# EAGLE design H3_MIDISmallController_Rev_1 (EAGLE 7.6.0)
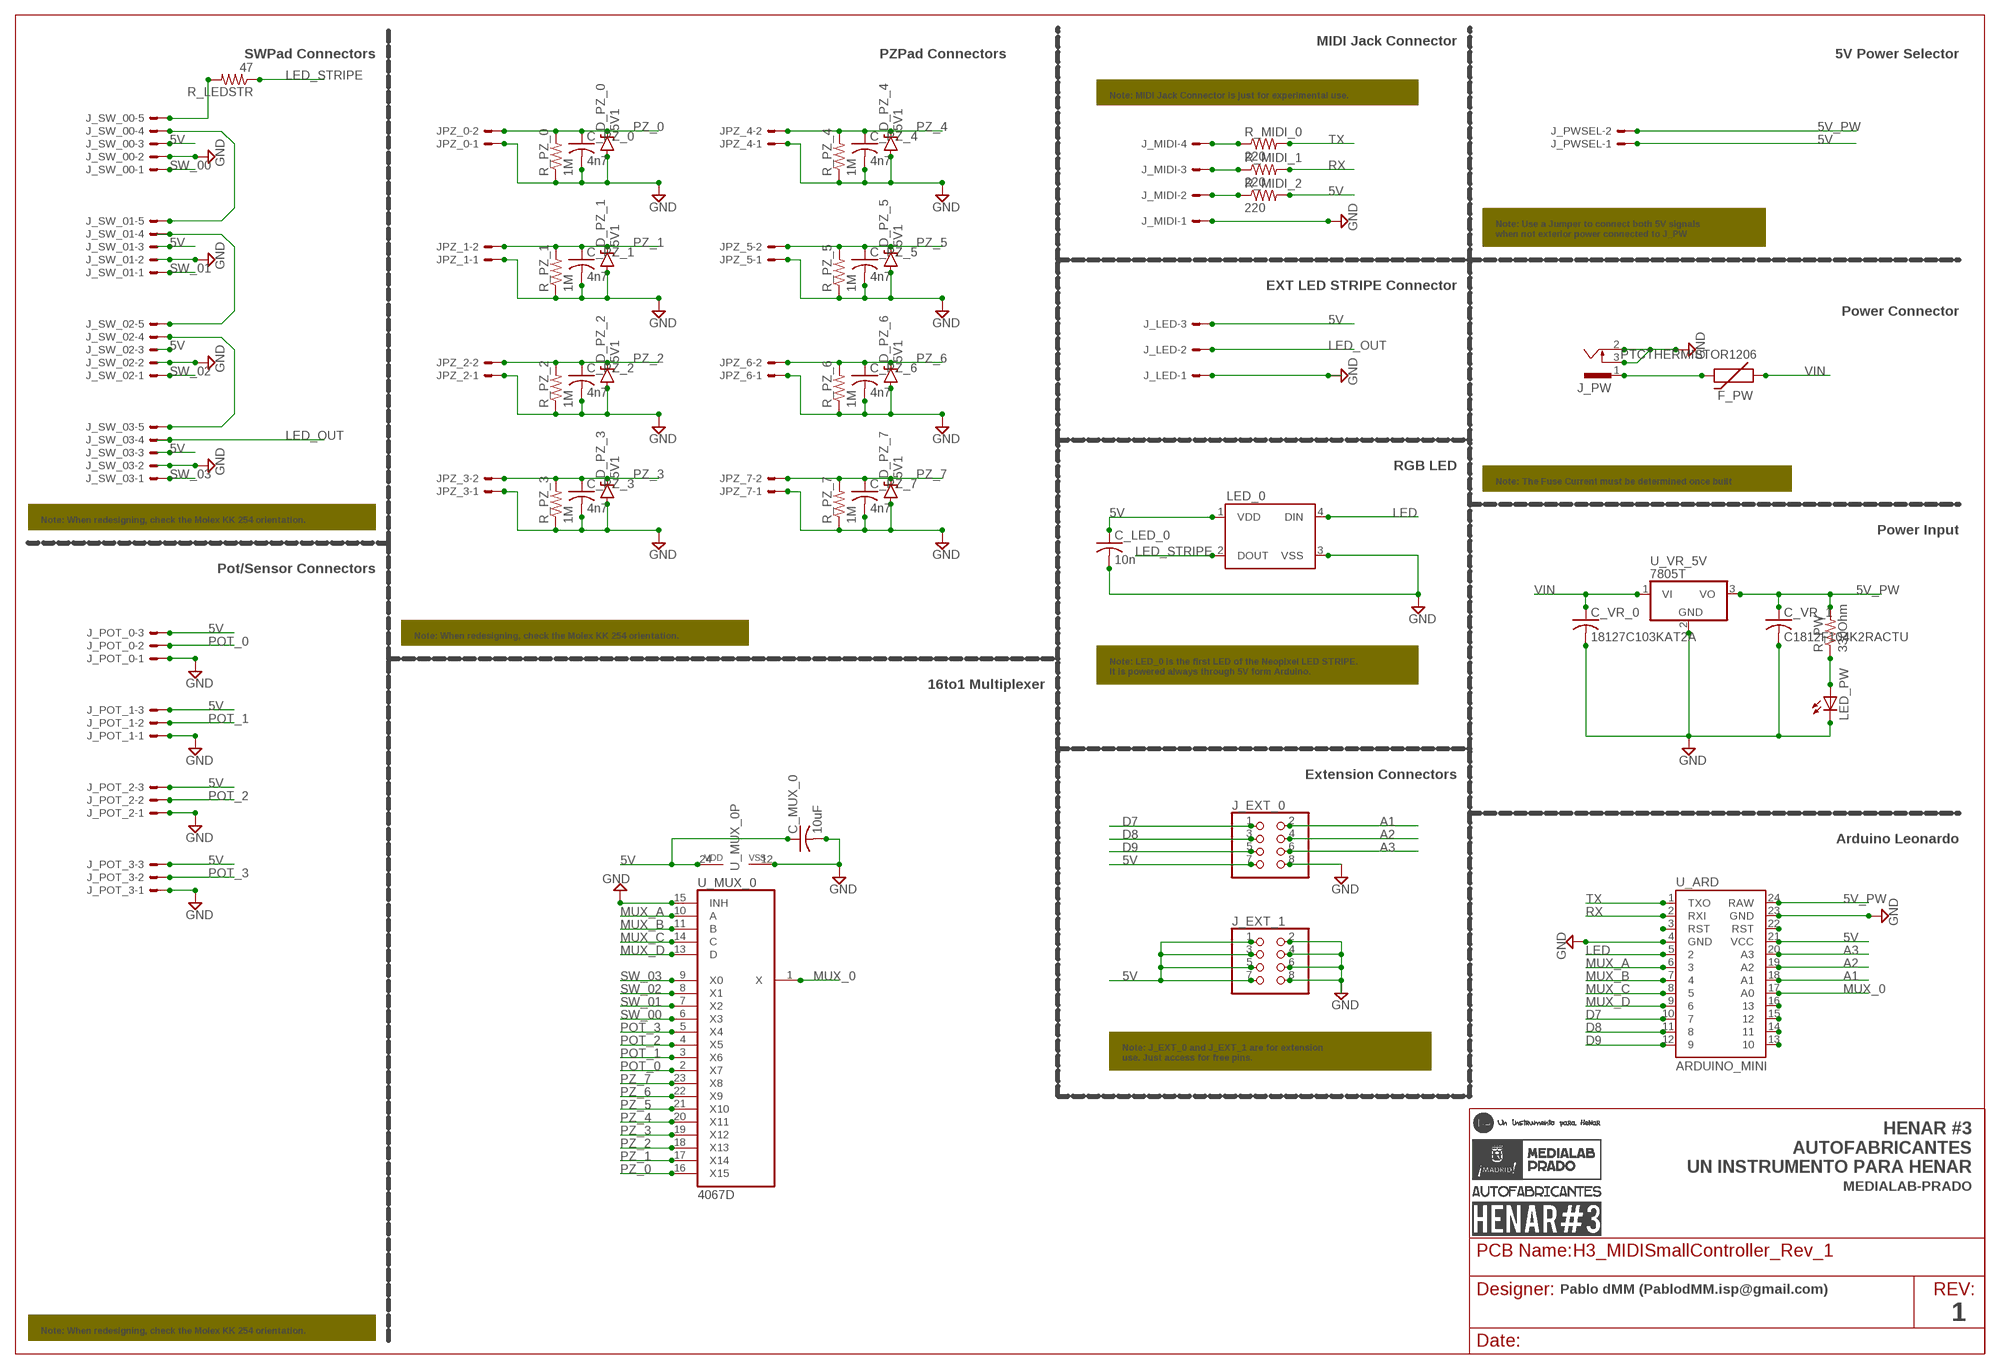
[diagram p0: schematic, sheet 1]

## Parts
C_LED_0  10n  C-USC1206  [C1206]
C_MUX_0  10uF  C-USC1206K  [C1206K]
C_PZ_0  4n7  C-USC1206  [C1206]
C_PZ_1  4n7  C-USC1206  [C1206]
C_PZ_2  4n7  C-USC1206  [C1206]
C_PZ_3  4n7  C-USC1206  [C1206]
C_PZ_4  4n7  C-USC1206  [C1206]
C_PZ_5  4n7  C-USC1206  [C1206]
C_PZ_6  4n7  C-USC1206  [C1206]
C_PZ_7  4n7  C-USC1206  [C1206]
C_VR_0  18127C103KAT2A  C-USC1206  [C1206]
C_VR_1  C1812F104K2RACTU  C-USC1206  [C1206]
D_PZ_0  5V1  DIODE-ZENER  [DIODE-BZT52]
D_PZ_1  5V1  DIODE-ZENER  [DIODE-BZT52]
D_PZ_2  5V1  DIODE-ZENER  [DIODE-BZT52]
D_PZ_3  5V1  DIODE-ZENER  [DIODE-BZT52]
D_PZ_4  5V1  DIODE-ZENER  [DIODE-BZT52]
D_PZ_5  5V1  DIODE-ZENER  [DIODE-BZT52]
D_PZ_6  5V1  DIODE-ZENER  [DIODE-BZT52]
D_PZ_7  5V1  DIODE-ZENER  [DIODE-BZT52]
F_PW  PTCTHERMISTOR1206  [PTC-1206]
J_EXT_0  PINHD-2X4/90  [2X04/90]
J_EXT_1  PINHD-2X4/90  [2X04/90]
J_LED  22-05-7038-03  [7395-03]
J_MIDI  22-05-7048-04  [7395-04]
J_POT_0  22-05-7038-03  [7395-03]
J_POT_1  22-05-7038-03  [7395-03]
J_POT_2  22-05-7038-03  [7395-03]
J_POT_3  22-05-7038-03  [7395-03]
J_PW  SCD-014A  [SCD-014-A]
J_PWSEL  22-05-7028-02  [7395-02]
J_SW_00  22-05-7058-05  [7395-05]
J_SW_01  22-05-7058-05  [7395-05]
J_SW_02  22-05-7058-05  [7395-05]
J_SW_03  22-05-7058-05  [7395-05]
JPZ_0  22-05-7028-02  [7395-02]
JPZ_1  22-05-7028-02  [7395-02]
JPZ_2  22-05-7028-02  [7395-02]
JPZ_3  22-05-7028-02  [7395-02]
JPZ_4  22-05-7028-02  [7395-02]
JPZ_5  22-05-7028-02  [7395-02]
JPZ_6  22-05-7028-02  [7395-02]
JPZ_7  22-05-7028-02  [7395-02]
LED_0  WS2812B  [WS2812B]
LED_PW  LEDSMT1206  [1206]
R_LEDSTR  47  R-US_M1206  [M1206]
R_MIDI_0  220  R-US_M1206  [M1206]
R_MIDI_1  220  R-US_M1206  [M1206]
R_MIDI_2  220  R-US_M1206  [M1206]
R_PW  330Ohm  R-US_M1206  [M1206]
R_PZ_0  1M  R-US_M1206  [M1206]
R_PZ_1  1M  R-US_M1206  [M1206]
R_PZ_2  1M  R-US_M1206  [M1206]
R_PZ_3  1M  R-US_M1206  [M1206]
R_PZ_4  1M  R-US_M1206  [M1206]
R_PZ_5  1M  R-US_M1206  [M1206]
R_PZ_6  1M  R-US_M1206  [M1206]
R_PZ_7  1M  R-US_M1206  [M1206]
U_ARD  ARDUINO_MINI  [ARDUINO_MINI]
U_MUX_0  4067D  [SO24W]
U_VR_5V  7805T  [TO220H]

## Nets
5V: C_LED_0.1 C_MUX_0.1 J_EXT_0.7 J_EXT_1.1 J_EXT_1.3 J_EXT_1.5 J_EXT_1.7 J_LED.3 J_POT_0.3 J_POT_1.3 J_POT_2.3 J_POT_3.3 J_PWSEL.1 J_SW_00.3 J_SW_01.3 J_SW_02.3 J_SW_03.3 LED_0.1(VDD) R_MIDI_2.2 U_ARD.21(VCC) U_MUX_0.24(VDD)
5V_PW [GND]: C_VR_1.1 J_PWSEL.2 R_PW.2 U_ARD.24(RAW) U_VR_5V.3(VO)
A1: J_EXT_0.2 U_ARD.18(A1)
A2: J_EXT_0.4 U_ARD.19(A2)
A3: J_EXT_0.6 U_ARD.20(A3)
D7: J_EXT_0.1 U_ARD.10
D8: J_EXT_0.3 U_ARD.11
D9: J_EXT_0.5 U_ARD.12
GND [GND]: C_LED_0.2 C_MUX_0.2 C_PZ_0.2 C_PZ_1.2 C_PZ_2.2 C_PZ_3.2 C_PZ_4.2 C_PZ_5.2 C_PZ_6.2 C_PZ_7.2 C_VR_0.2 C_VR_1.2 D_PZ_0.A D_PZ_1.A D_PZ_2.A D_PZ_3.A D_PZ_4.A D_PZ_5.A D_PZ_6.A D_PZ_7.A J_EXT_0.8 J_EXT_1.2 J_EXT_1.4 J_EXT_1.6 J_EXT_1.8 J_LED.1 J_MIDI.1 J_POT_0.1 J_POT_1.1 J_POT_2.1 J_POT_3.1 J_PW.2 J_PW.3 J_SW_00.2 J_SW_01.2 J_SW_02.2 J_SW_03.2 JPZ_0.1 JPZ_1.1 JPZ_2.1 JPZ_3.1 JPZ_4.1 JPZ_5.1 JPZ_6.1 JPZ_7.1 LED_0.3(VSS) LED_PW.C R_PZ_0.1 R_PZ_1.1 R_PZ_2.1 R_PZ_3.1 R_PZ_4.1 R_PZ_5.1 R_PZ_6.1 R_PZ_7.1 U_ARD.4(GND) U_ARD.23(GND) U_MUX_0.12(VSS) U_MUX_0.15(INH) U_VR_5V.2(GND)
LED: LED_0.4(DIN) U_ARD.5
LED_IN2: J_SW_01.4 J_SW_02.5
LED_OUT: J_LED.2 J_SW_03.4
LED_STRIPE: LED_0.2(DOUT) R_LEDSTR.1
MUX_0: U_ARD.17(A0) U_MUX_0.1(X)
MUX_A: U_ARD.6 U_MUX_0.10(A)
MUX_B: U_ARD.7 U_MUX_0.11(B)
MUX_C: U_ARD.8 U_MUX_0.14(C)
MUX_D: U_ARD.9 U_MUX_0.13(D)
N$1: LED_PW.A R_PW.1
N$2: J_SW_00.4 J_SW_01.5
N$3: U_ARD.3(RST)
N$4: J_SW_00.5 R_LEDSTR.2
N$5: J_SW_02.4 J_SW_03.5
N$7: U_ARD.22(RST)
N$9: U_ARD.16
N$10: U_ARD.15
N$11: U_ARD.13
N$12: F_PW.2 J_PW.1
N$13: U_ARD.14
N$15: J_MIDI.2 R_MIDI_2.1
N$16: J_MIDI.3 R_MIDI_1.1
N$17: J_MIDI.4 R_MIDI_0.1
POT_0: J_POT_0.2 U_MUX_0.2(X7)
POT_1: J_POT_1.2 U_MUX_0.3(X6)
POT_2: J_POT_2.2 U_MUX_0.4(X5)
POT_3: J_POT_3.2 U_MUX_0.5(X4)
PZ_0: C_PZ_0.1 D_PZ_0.C JPZ_0.2 R_PZ_0.2 U_MUX_0.16(X15)
PZ_1: C_PZ_1.1 D_PZ_1.C JPZ_1.2 R_PZ_1.2 U_MUX_0.17(X14)
PZ_2: C_PZ_2.1 D_PZ_2.C JPZ_2.2 R_PZ_2.2 U_MUX_0.18(X13)
PZ_3: C_PZ_3.1 D_PZ_3.C JPZ_3.2 R_PZ_3.2 U_MUX_0.19(X12)
PZ_4: C_PZ_4.1 D_PZ_4.C JPZ_4.2 R_PZ_4.2 U_MUX_0.20(X11)
PZ_5: C_PZ_5.1 D_PZ_5.C JPZ_5.2 R_PZ_5.2 U_MUX_0.21(X10)
PZ_6: C_PZ_6.1 D_PZ_6.C JPZ_6.2 R_PZ_6.2 U_MUX_0.22(X9)
PZ_7: C_PZ_7.1 D_PZ_7.C JPZ_7.2 R_PZ_7.2 U_MUX_0.23(X8)
RX: R_MIDI_1.2 U_ARD.2(RXI)
SW_00: J_SW_00.1 U_MUX_0.6(X3)
SW_01: J_SW_01.1 U_MUX_0.7(X2)
SW_02: J_SW_02.1 U_MUX_0.8(X1)
SW_03: J_SW_03.1 U_MUX_0.9(X0)
TX: R_MIDI_0.2 U_ARD.1(TXO)
VIN: C_VR_0.1 F_PW.1 U_VR_5V.1(VI)

## Notes on the sheet
- MIDI Jack Connector
- SWPad Connectors | PZPad Connectors | 5V Power Selector
- Note: MIDI Jack Connector is just for experimental use.
- Note: Use a Jumper to connect both 5V signals
  when not exterior power connected to J_PW
- EXT LED STRIPE Connector
- Power Connector
- RGB LED
- Note: The Fuse Current must be determined once built
- Note: When redesigning, check the Molex KK 254 orientation.
- Power Input
- Pot/Sensor Connectors
- Note: When redesigning, check the Molex KK 254 orientation.
- Note: LED_0 is the first LED of the Neopixel LED STRIPE.
  It is powered always through 5V form Arduino.
- 16to1 Multiplexer
- Extension Connectors
- Arduino Leonardo
- Note: J_EXT_0 and J_EXT_1 are for extension
  use. Just access for free pins.
- HENAR #3
  AUTOFABRICANTES
  UN INSTRUMENTO PARA HENAR
- MEDIALAB-PRADO
- Pablo dMM (PablodMM.isp@gmail.com)
- 1
- Note: When redesigning, check the Molex KK 254 orientation.

## Library data of the parts
C_LED_0 C_MUX_0 C_PZ_0 C_PZ_1-C_PZ_7 C_VR_0 C_VR_1 = adafruit:C-US: CAPACITOR, American symbol
D_PZ_0 D_PZ_1-D_PZ_7 = SparkFun-DiscreteSemi:DIODE-ZENER: Zener Diode Production Part - 8199 3.4V Zener Voltage; PROD-ID: DIO-08199; VALUE: BZT52
F_PW = SparkFun-PowerIC:PTC: Resettable Fuse PTC Resettable Fuse. Spark Fun Electronics SKU : COM-08357; PROD_ID: RES-08585
J_EXT_0 J_EXT_1 = adafruit:PINHD-2X4: PIN HEADER
J_LED J_POT_0 J_POT_1-J_POT_3 = con-molex:22-?-03: CONNECTOR wire to board 2.54 mm (.1 inch) pitch header; OC_FARNELL: unknown; OC_NEWARK: unknown
J_MIDI = con-molex:22-?-04: CONNECTOR wire to board 2.54 mm (.1 inch) pitch header; OC_FARNELL: unknown; OC_NEWARK: unknown
J_PW = con-shiua-chyuan:SCD-014A: Power Jack 2.5mm; OC_FARNELL: unknown; OC_NEWARK: unknown
J_PWSEL JPZ_0 JPZ_1-JPZ_7 = con-molex:22-?-02: CONNECTOR wire to board 2.54 mm (.1 inch) pitch header; OC_FARNELL: 9731601; OC_NEWARK: unknown
J_SW_00 J_SW_01-J_SW_03 = con-molex:22-?-05: CONNECTOR wire to board 2.54 mm (.1 inch) pitch header; OC_FARNELL: unknown; OC_NEWARK: unknown
LED_0 = SparkFun-LED:WS2812B: WS2812B - Intelligent control LED integrated light source Technical Specifications: Power Supply Voltage (VDD): 3.5 to 5.3 V Input Voltage (VI): -0.5 to VDD+0.5 V Operating Junction Temperature (Topt): -25°C to +80°C Storage Temperature Range (Tstg): -55°C to +150°C; PROD_ID: DIO-12503
LED_PW = adafruit:LED: LED OSRAM: - CHIPLED LG R971, LG N971, LY N971, LG Q971, LY Q971, LO R971, LY R971 LH N974, LH R974 LS Q976, LO Q976, LY Q976 LO Q996 - Hyper CHIPLED LW Q18S LB Q993, LB Q99A, LB R99A - SideLED LS A670, LO A670, LY A670, LG A670, LP A670 LB A673, LV A673, LT A673, LW A673 LH A674 LY A675 LS A676, LA A676, LO A676, LY A676, LW A676 LS A679, LY A679, LG A679 - Hyper Micro SIDELED® LS Y876, LA Y876, LO Y876, LY Y876 LT Y87S - SmartLED LW L88C, LW L88S LB L89C, LB L89S, LG L890 LS L89K, LO L89K, LY L89K LS L896, LA L896, LO L896, LY L896 - TOPLED LS T670, LO T670, LY T670, LG T670, LP T670 LSG T670, LSP T670, LSY T670, LOP T670, LYG T670 LG T671, LOG T671, LSG T671 LB T673, LV T673, LT T673, LW T673 LH T674 LS T676, LA T676, LO T676, LY T676, LB T676, LH T676, LSB T676, LW T676 LB T67C, LV T67C, LT T67C, LS T67K, LO T67K, LY T67K, LW E67C LS E67B, LA E67B, LO E67B, LY E67B, LB E67C, LV E67C, LT E67C LW T67C LS T679, LY T679, LG T679 LS T770, LO T770, LY T770, LG T770, LP T770 LB T773, LV T773, LT T773, LW T773 LH T774 LS E675, LA E675, LY E675, LS T675 LS T776, LA T776, LO T776, LY T776, LB T776 LHGB T686 LT T68C, LB T68C - Hyper Mini TOPLED® LB M676 - Mini TOPLED Santana® LG M470 LS M47K, LO M47K, LY M47K Source: http://www.osram.convergy.de/
R_LEDSTR R_MIDI_0 R_MIDI_1 R_MIDI_2 R_PW R_PZ_0 R_PZ_1-R_PZ_7 = adafruit:R-US_: RESISTOR, American symbol
U_ARD = SparkFun-Boards:ARDUINO_MINI: Arduino Pro Mini footprint
U_MUX_0 = 40xx:4067: 16-channel ANALOG MULTIPLEXER
U_VR_5V = adafruit:78*: Positive VOLTAGE REGULATOR Added bigger pads to the TO-92 package

## Net classes
1 GND: width 0.635 mm

## Board
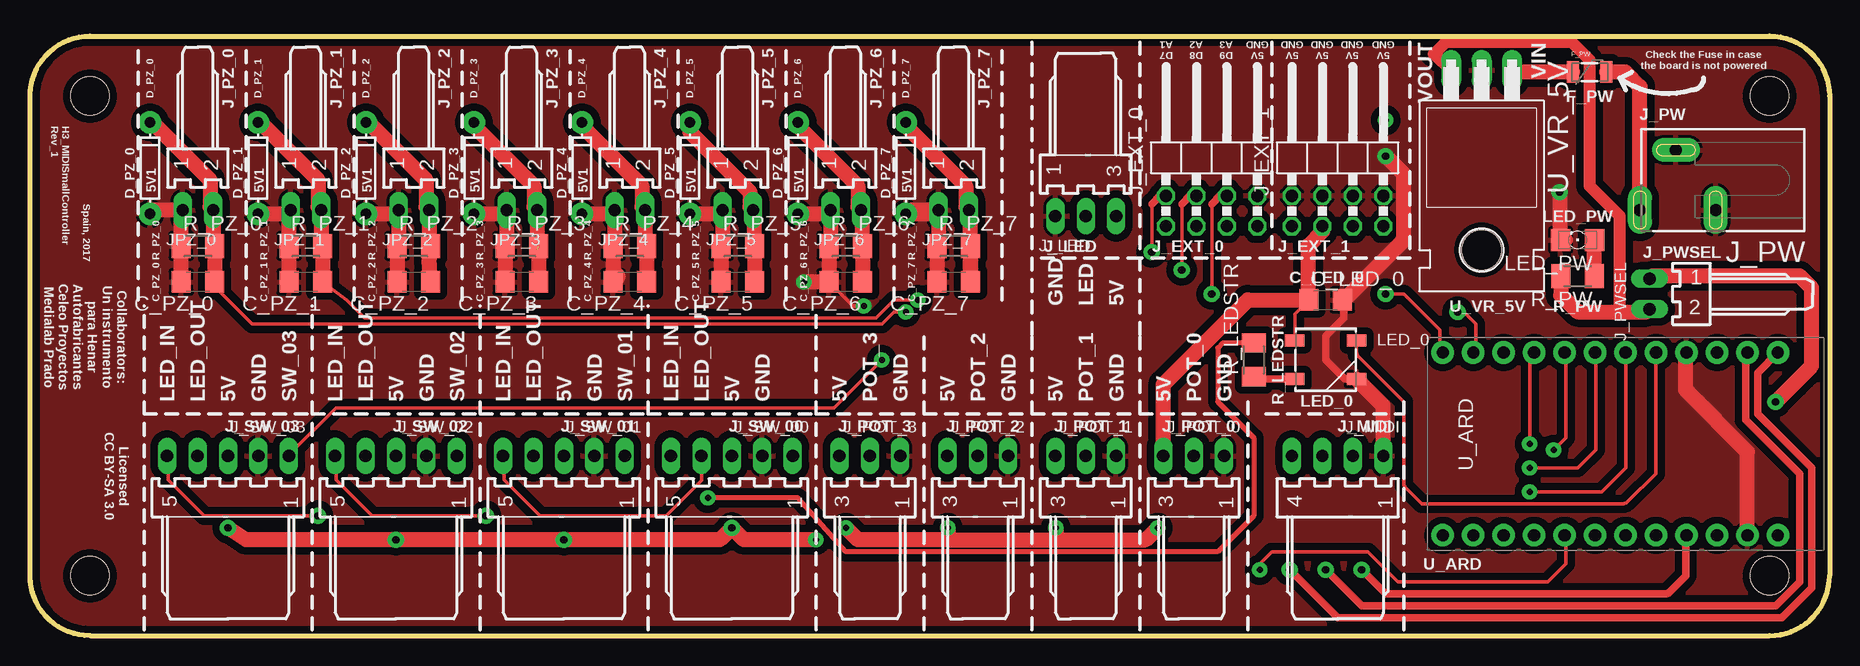
[diagram p1: board, top side]
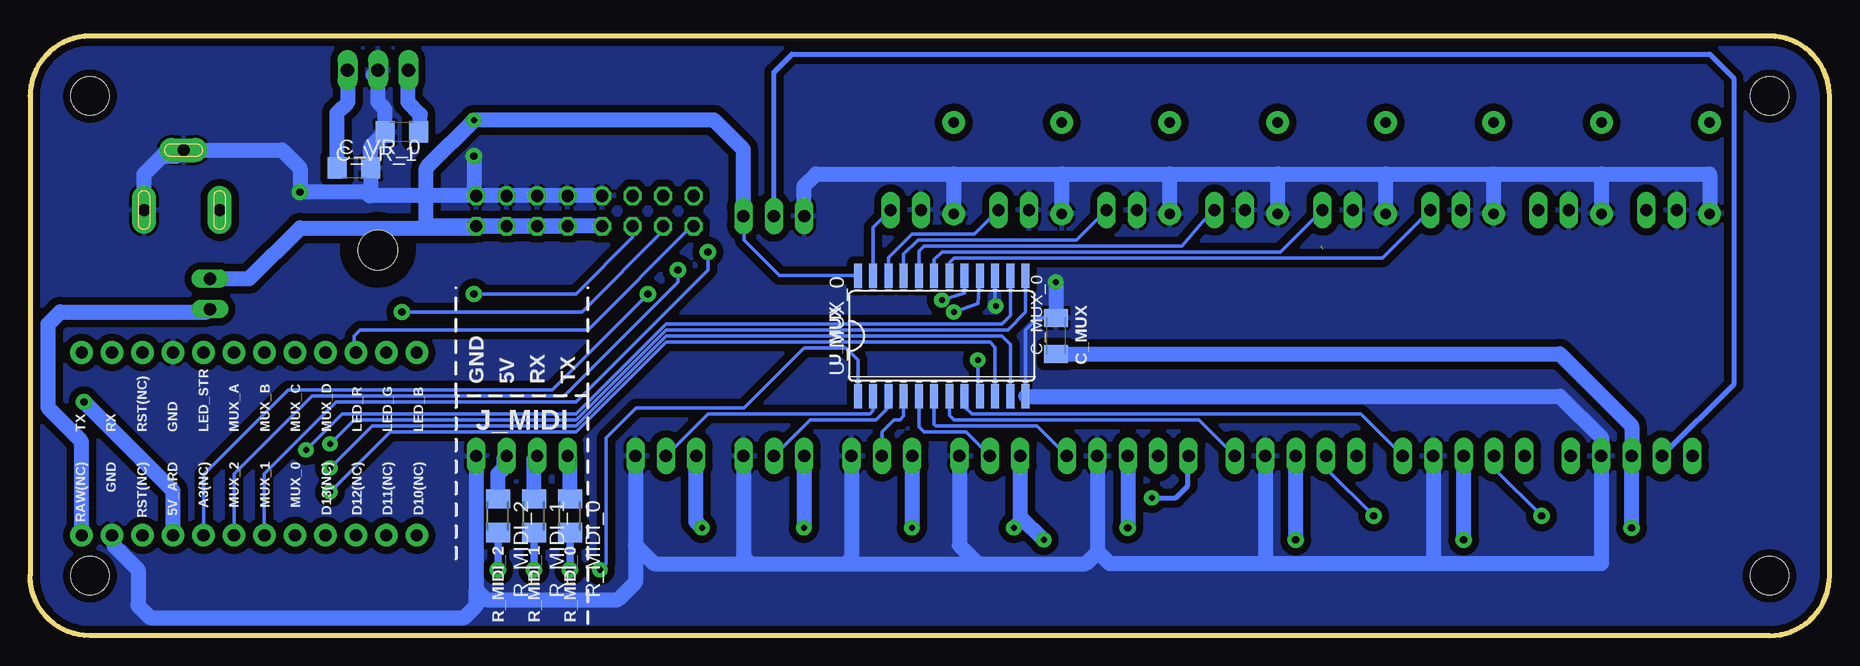
[diagram p2: board, bottom side, seen from below]

Size 150 x 50 mm. Coordinates in mm from the lower left corner, seen from the top.
Outline: 5,0 145,0 arc90 150,5 150,45 arc90 145,50 5,50 arc90 0,45 0,5 arc90 5,0
Copper layers (1*16): Top 0.035mm / dielectric 1.5mm / Bottom 0.035mm
Design rules "default *": minimum track width 10mil, minimum drill 25mil, track to track 10mil, track to pad 10mil, pad to pad 10mil, via to via 10mil, smd to smd 8mil, copper to edge 20mil, drill to drill 8mil, minimum pad ring 10mil, minimum via ring 15mil, stop-mask expansion 4mil, vias tented up to drill 0mil, thermal gap 10mil
Holes 3.2 mm at 5,5 5,45 145,45 145,5

### Footprints (pad centres in the part's own frame; a part is rotated, then mirrored left to right if it is on the bottom)
C1206 = smd 1.6 x 1.8: 1 -1.4,0; 2 1.4,0
C1206K = smd 1.5 x 2: 1 -1.5,0; 2 1.5,0
DIODE-BZT52 = drill 0.9 pad 1.88: A -3.81,0; C 3.81,0
PTC-1206 = smd 1 x 1.8: 1 -1.4,0; 2 1.4,0
2X04/90 = drill 1.016 octagon: 1 -3.81,-6.35; 2 -3.81,-3.81; 3 -1.27,-6.35; 4 -1.27,-3.81; 5 1.27,-6.35; 6 1.27,-3.81; 7 3.81,-6.35; 8 3.81,-3.81
7395-03 = drill 1.016 long: 1 2.54,0; 2 0,0; 3 -2.54,0
7395-04 = drill 1.016 long: 1 3.81,0; 2 1.27,0; 3 -1.27,0; 4 -3.81,0
SCD-014-A = drill 1 pad 2 long: 1 -2.5,13.8; 2 -2.5,7.5; 3 2.5,10.8
7395-02 = drill 1.016 long: 1 1.27,0; 2 -1.27,0
7395-05 = drill 1.016 long: 1 5.08,0; 2 2.54,0; 3 0,0; 4 -2.54,0; 5 -5.08,0
WS2812B = smd 1.651 x 1: 1 -2.577,1.6; 2 -2.577,-1.6; 3 2.577,-1.6; 4 2.577,1.6
1206 = smd 1.6 x 1.803: A -1.422,0; C 1.422,0
M1206 = smd 1.6 x 2: 1 -1.4,0; 2 1.4,0
ARDUINO_MINI = drill 1.016 pad 1.88: 1 -7.62,12.7; 2 -7.62,10.16; 3 -7.62,7.62; 4 -7.62,5.08; 5 -7.62,2.54; 6 -7.62,0; 7 -7.62,-2.54; 8 -7.62,-5.08; 9 -7.62,-7.62; 10 -7.62,-10.16; 11 -7.62,-12.7; 12 -7.62,-15.24; 13 7.62,-15.24; 14 7.62,-12.7; 15 7.62,-10.16; 16 7.62,-7.62; 17 7.62,-5.08; 18 7.62,-2.54; 19 7.62,0; 20 7.62,2.54; 21 7.62,5.08; 22 7.62,7.62; 23 7.62,10.16; 24 7.62,12.7
SO24W = smd 0.66 x 2.032: 1 -6.985,-5.029; 2 -5.715,-5.029; 3 -4.445,-5.029; 4 -3.175,-5.029; 5 -1.905,-5.029; 6 -0.635,-5.029; 7 0.635,-5.029; 8 1.905,-5.029; 9 3.175,-5.029; 10 4.445,-5.029; 11 5.715,-5.029; 12 6.985,-5.029; 13 6.985,5.029; 14 5.715,5.029; 15 4.445,5.029; 16 3.175,5.029; 17 1.905,5.029; 18 0.635,5.029; 19 -0.635,5.029; 20 -1.905,5.029; 21 -3.175,5.029; 22 -4.445,5.029; 23 -5.715,5.029; 24 -6.985,5.029
TO220H = drill 1.118 long: 1 -2.54,-10.16; 2 0,-10.16; 3 2.54,-10.16 | hole 3.302: 0,4.826

### Placement (x,y rotation side)
C_LED_0  108,28 0 top
C_MUX_0  64.5,25 90 bottom
C_PZ_0  14,29.5 180 top
C_PZ_1  23,29.5 180 top
C_PZ_2  32,29.5 180 top
C_PZ_3  41,29.5 180 top
C_PZ_4  50,29.5 180 top
C_PZ_5  59,29.5 180 top
C_PZ_6  68,29.5 180 top
C_PZ_7  77,29.5 180 top
C_VR_0  123,39 0 bottom
C_VR_1  119,42 180 bottom
D_PZ_0  10,39 90 top
D_PZ_1  19,39 90 top
D_PZ_2  28,39 90 top
D_PZ_3  37,39 90 top
D_PZ_4  46,39 90 top
D_PZ_5  55,39 90 top
D_PZ_6  64,39 90 top
D_PZ_7  73,39 90 top
F_PW  130,47 0 top
J_EXT_0  98.5,40.5 0 top
J_EXT_1  109,40.5 0 top
J_LED  88,35 180 top
J_MIDI  109,15 0 top
J_POT_0  97,15 0 top
J_POT_1  88,15 0 top
J_POT_2  79,15 0 top
J_POT_3  70,15 0 top
J_PW  148,38 90 top
J_PWSEL  135,28.5 90 top
J_SW_00  58.5,15 0 top
J_SW_01  44.5,15 0 top
J_SW_02  30.5,15 0 top
J_SW_03  16.5,15 0 top
JPZ_0  14,35.5 180 top
JPZ_1  23,35.5 180 top
JPZ_2  32,35.5 180 top
JPZ_3  41,35.5 180 top
JPZ_4  50,35.5 180 top
JPZ_5  59,35.5 180 top
JPZ_6  68,35.5 180 top
JPZ_7  77,35.5 180 top
LED_0  108,23 0 top
LED_PW  129,33 180 top
R_LEDSTR  102,23 90 top
R_MIDI_0  105,10 270 bottom
R_MIDI_1  108,10 270 bottom
R_MIDI_2  111,10 270 bottom
R_PW  129,30 180 top
R_PZ_0  14,32.5 0 top
R_PZ_1  23,32.5 0 top
R_PZ_2  32,32.5 0 top
R_PZ_3  41,32.5 0 top
R_PZ_4  50,32.5 0 top
R_PZ_5  59,32.5 0 top
R_PZ_6  68,32.5 0 top
R_PZ_7  77,32.5 0 top
U_ARD  133,16 270 top
U_MUX_0  74,25 0 bottom
U_VR_5V  121,37 180 top

### Tracks (layer width: path | path; a pad name or v marks a point on that pad's centre or on a via)
5V  (via drill 0.5, 0.6)
  Top 0.305: LED_0.1 105.42,26.82 C_LED_0.1
  Top 0.61: v111,5.5 113,3.5 136.37,3.5 arc45 136.59,3.59 138,5 138,8.19 arc-45 U_ARD.21
  Top 1.27: v145.5,19.5 148.5,22.5 148.5,29 147.5,30 135.23,30 J_PWSEL.1 | J_EXT_1.3 107.73,33.73 106.5,32.5 106.5,28.1 C_LED_0.1 101.5,28 94.46,20.96 J_POT_0.3 | v68,9 69,8 76.5,8 | v94,9 93,8 85.5,8 | v85.5,9 85.5,8 | v76.5,9 76.5,8 | 76.5,8 85.5,8 | v16.5,9 18,8 v30.5,8 v44.5,8 57.5,8 v58.5,9 59.5,8 v65.5,8
  Bottom 0.305: U_MUX_0.24 87.53,30.03 90.5,33 90.5,34.96 J_LED.3
  Bottom 0.61: R_MIDI_2.2 v111,5.5
  Bottom 1.27: U_ARD.21 138.08,12.08 v145.5,19.5 | J_PWSEL.1 131.73,29.77 127.5,34 117,34 | 117,34 112.96,34 J_EXT_1.7 J_EXT_1.5 J_EXT_1.3 J_EXT_1.1 J_EXT_0.7 116.64,34.15 arc-45 117,34 | 117,34 117,38.74 arc45 116.81,39.19 v113,43 93,43 90.54,40.54 J_LED.3 | v68,9 67.46,9.54 J_POT_3.3 67.46,9.96 v65.5,8 | v94,9 94.5,9.5 94.5,14.96 J_POT_0.3 | J_POT_2.3 76.46,9.04 v76.5,9 | J_POT_1.3 85.46,9.04 v85.5,9 | J_SW_00.3 v58.5,9 | C_MUX_0.1 22.5,23.5 16.5,17.5 J_SW_03.3 v16.5,9 | v44.5,8 J_SW_01.3 | v30.5,8 J_SW_02.3
5V_PW
  Top 1.016: 132.5,27 132.5,35 130,37.5 130,48 128.5,49.5 118,49.5 117,48.5 117.12,48.5 U_VR_5V.3
  Top 1.27: J_PWSEL.2 134.77,27 132.5,27 129,27 127.6,28.4 R_PW.2
  Bottom 1.27: C_VR_1.1 117.46,42.14 117.46,43.46 118.5,44.5 118.5,47.12 U_VR_5V.3 | U_ARD.24 145.7,16.2 148.5,19 148.5,26 147.5,27 135.23,27 J_PWSEL.2
A1  (via drill 0.6)
  Top 0.305: 93.5,36 v93.5,32
  Top 0.61: J_EXT_0.2 94.19,36.69 93.5,36
  Bottom 0.305: v93.5,32 93.5,30.5 104.5,19.5 124.5,19.5 130.5,13.5 130.5,8.42 U_ARD.18
A2  (via drill 0.6)
  Top 0.305: 96,36 v96,30.5
  Top 0.61: J_EXT_0.4 96.69,36.69 96,36
  Bottom 0.305: v96,30.5 96,29.5 105.5,20 126.5,20 133,13.5 U_ARD.19
A3  (via drill 0.6)
  Top 0.305: 98.5,36 v98.5,28.5
  Top 0.61: J_EXT_0.6 99.19,36.69 98.5,36
  Bottom 0.305: U_ARD.20 135.54,13.46 128.5,20.5 106.5,20.5 v98.5,28.5
D7
  Bottom 0.305: J_EXT_0.1 94.85,34.15 103.5,25.5 122.5,25.5 123,25 123,23.78 U_ARD.10
D8  (via drill 0.6)
  Top 0.305: v119,27 119.5,27 120.5,26 120.5,23.82 U_ARD.11
  Bottom 0.305: J_EXT_0.3 97.23,33.77 104,27 v119,27
D9  (via drill 0.6)
  Top 0.305: v113,28.5 114.5,28.5 117.5,25.5 117.5,23.88 U_ARD.12
  Bottom 0.305: J_EXT_0.5 99.77,33.23 104.5,28.5 v113,28.5
GND  (via drill 0.5, 0.6)
  Top 0.305: v69.5,27.5 68.6,27.5 C_PZ_6.2
  Top 0.61: LED_0.3 109.6,21.4 108,23 108,25 109.5,26.5 109.5,27.9 C_LED_0.2
  Top 1.27: 128,33 LED_PW.C 127.5,33.08 v127.5,37 | C_LED_0.2 109.5,28 114.5,33 114.5,38.5 v113,40 | J_MIDI.1 112.81,19.17 LED_0.3 | C_PZ_0.2 R_PZ_0.1 12.6,35.37 JPZ_0.1 10.31,35.5 D_PZ_0.A | C_PZ_1.2 R_PZ_1.1 21.6,35 | 21.6,35 21.6,35.37 JPZ_1.1 | D_PZ_1.A 21.41,35.19 21.6,35 | D_PZ_2.A 30.42,35.19 JPZ_2.1 30.73,32.63 R_PZ_2.1 C_PZ_2.2 | D_PZ_3.A 39.42,35.19 JPZ_3.1 39.73,32.63 R_PZ_3.1 C_PZ_3.2 | D_PZ_4.A 48.42,35.19 JPZ_4.1 48.73,32.63 R_PZ_4.1 48.6,30.4 49,30 49,29.9 C_PZ_4.2 | D_PZ_5.A 57.42,35.19 JPZ_5.1 57.73,32.63 R_PZ_5.1 C_PZ_5.2 | D_PZ_6.A 66.42,35.19 JPZ_6.1 66.73,32.63 R_PZ_6.1 C_PZ_6.2 v64.5,29.5 | D_PZ_7.A 75.42,35.19 JPZ_7.1 | JPZ_7.1 75.73,32.63 R_PZ_7.1 C_PZ_7.2 | JPZ_7.1 73.5,35.5 v73,35 | U_ARD.23 143.16,15.34 138,20.5 138,23.54 U_ARD.4
  Bottom 0.305: U_MUX_0.12 67.02,25.48 66,26.5 C_MUX_0.2 | U_MUX_0.15 69.56,27.55 v69.5,27.5
  Bottom 1.27: J_PW.2 140.5,38.5 139,40 137.7,40 J_PW.3 129,40.5 127.5,39 v127.5,37 122,37 | 121.4,46.76 U_VR_5V.2 121,44.5 120.4,43.9 C_VR_1.2 121.6,40.8 C_VR_0.2 121.6,37.4 122,37 | J_EXT_0.8 J_EXT_1.2 J_EXT_1.4 J_EXT_1.6 J_EXT_1.8 | J_EXT_1.8 121.69,36.69 122,37 | 33,6 19,6 19.04,6.04 J_SW_03.2 19,15.04 19,16.5 22.47,19.97 U_MUX_0.12 | 33,6 47,6 | 47,6 60,6 61,7 | 61,7 61,14.96 J_SW_00.2 | J_SW_01.2 47.04,6.04 47,6 | J_SW_02.2 33.04,6.04 33,6 | J_MIDI.1 112.81,3.81 | 112.81,3.81 112.81,2.5 113.72,1.59 arc45 113.94,1.5 140,1.5 140.91,2.41 arc45 141,2.63 141,5.5 142.91,7.41 arc45 143,7.63 | 112.81,3.81 112,3 101,3 99.54,4.46 99.54,7.54 | v113,40 113,36.88 J_EXT_1.8 | J_POT_3.1 72.54,7.54 71,6 | 71,6 62,6 61,7 | J_POT_0.1 99.54,7.54 | 99.54,7.54 98,6 90,6 | 90,6 82,6 | 82,6 71,6 | J_POT_2.1 81.54,6.46 82,6 | J_POT_1.1 90.54,6.54 90,6 | D_PZ_1.A 19,38.5 | 19,38.5 10,38.5 D_PZ_0.A | D_PZ_2.A 28,38.5 | 28,38.5 19,38.5 | D_PZ_3.A 37,38.5 | 37,38.5 28,38.5 | D_PZ_4.A 46,38.5 | 46,38.5 37,38.5 | D_PZ_5.A 55,38.5 | 55,38.5 46,38.5 | D_PZ_6.A 64,38.5 | 64,38.5 55,38.5 | v73,35 73,38.5 | 73,38.5 64,38.5 | J_LED.1 85.46,37.54 84.5,38.5 73,38.5 | v64.5,29.5 C_MUX_0.2
  pour Top (isolate 0.61): 5,0 145,0 arc90 150,5 150,45 arc90 145,50 5,50 arc90 0,45 0,5 arc90
  pour Bottom (isolate 0.61): 5,0 145,0 arc90 150,5 150,45 arc90 145,50 5,50 arc90 0,45 0,5 arc90
LED
  Top 0.305: LED_0.4 110.58,23.69 arc45 110.76,23.24 114.5,19.5 114.5,12.76 arc45 114.69,12.31 116,11 132.74,11 arc45 133.19,11.19 135.5,13.5 135.5,23.52 arc-45 U_ARD.5
LED_IN2  (via drill 0.6)
  Top 0.305: v38,10 28.5,10 25.5,13 25.5,14.92 J_SW_02.5
  Bottom 0.305: J_SW_01.4 41.96,13.96 v38,10
LED_OUT
  Bottom 0.406: J_LED.2 88,47 86.5,48.5 10,48.5 8,46.5 8,20.96 J_SW_03.4
LED_STRIPE
  Top 0.61: LED_0.2 102.2,21.4 R_LEDSTR.1
MUX_0  (via drill 0.5)
  Top 0.305: v102.5,5.5 102.5,6 103.5,7 111.5,7 114,4.5 126.5,4.5 128,6 128,8.3 U_ARD.17
  Bottom 0.305: U_MUX_0.1 80.98,22.98 82,24 85.5,24 90.5,19 99.5,19 102,16.5 102,6 v102.5,5.5
MUX_A  (via drill 0.5)
  Top 0.305: v125,12 131,12 133,14 U_ARD.6
  Bottom 0.305: U_MUX_0.10 69.56,24.05 70,24.5 97,24.5 104.5,17 120,17 v125,12
MUX_B  (via drill 0.5)
  Top 0.305: v125,14 129,14 130.5,15.5 130.5,23.58 U_ARD.7
  Bottom 0.305: U_MUX_0.11 68.28,24.29 69,25 97,25 104.5,17.5 121.5,17.5 v125,14
MUX_C  (via drill 0.5)
  Top 0.305: v127,15.5 128,16.5 128,23.54 U_ARD.8
  Bottom 0.305: U_MUX_0.14 68.28,26.71 69,26 97,26 104.5,18.5 124,18.5 v127,15.5
MUX_D  (via drill 0.5)
  Top 0.305: v125,16 125,23.24 U_ARD.9
  Bottom 0.305: U_MUX_0.13 67.02,26.98 68.5,25.5 97,25.5 104.5,18 123,18 v125,16
N$1
  Top 1.27: R_PW.1 130.4,32.98 LED_PW.A
N$2
  Top 0.305: J_SW_00.4 55.96,12.96 53,10 42.5,10 39.5,13 39.5,14.92 J_SW_01.5
N$4  (via drill 0.5)
  Top 0.406: R_LEDSTR.2 99.4,24.4 99,24 99,19.5 102,16.5 102,10 99,7 68,7 64,11.5 v56.5,11.5
  Bottom 0.406: v56.5,11.5 54.5,11.5 53.5,12.5 53.5,14.92 J_SW_00.5
N$5  (via drill 0.6)
  Top 0.305: v24,10 14.5,10 11.5,13 11.5,14.92 J_SW_03.5
  Bottom 0.305: J_SW_02.4 27.96,13.96 v24,10
N$6
  pour Top (isolate 0.61): 5,0 145,0 arc90 150,5 150,45 arc90 145,50 5,50 arc90 0,45 0,5 arc90
N$8
  pour Bottom (isolate 0.61): 5,0 145,0 arc90 150,5 150,45 arc90 145,50 5,50 arc90 0,45 0,5 arc90
N$12
  Top 1.27: J_PW.1 134.2,45.8 133,47 F_PW.2
N$15
  Bottom 1.27: R_MIDI_2.1 111,13.5 110.5,14 110.5,14.77 J_MIDI.2
N$16
  Bottom 1.27: R_MIDI_1.1 108,14.73 J_MIDI.3
N$17
  Bottom 1.27: R_MIDI_0.1 105,14.81 J_MIDI.4
POT_0
  Bottom 0.305: U_MUX_0.2 79.72,18.79 80,18.5 93.5,18.5 J_POT_0.2
POT_1
  Bottom 0.305: U_MUX_0.3 78.44,19.05 79.5,18 85,18 J_POT_1.2
POT_2
  Bottom 0.305: U_MUX_0.4 77.17,18.32 77.5,18 78,18 79,17 J_POT_2.2 79,14.5
POT_3
  Bottom 0.305: U_MUX_0.5 75.91,17.41 75.5,17 72,17 J_POT_3.2
PZ_0  (via drill 0.5)
  Top 0.305: C_PZ_0.1 15.4,29.1 18.5,26 71,26 72,27 v73,27
  Top 1.27: C_PZ_0.1 R_PZ_0.2 15.27,32.63 JPZ_0.2 15,35.77 15,38 10.19,42.81 D_PZ_0.C
  Bottom 0.305: v73,27 71,27.7 U_MUX_0.16
PZ_1  (via drill 0.5)
  Top 0.305: C_PZ_1.1 26.4,28 27.9,26.5 70.5,26.5 72,28 v74,28
  Top 1.27: C_PZ_1.1 R_PZ_1.2 24.27,32.63 JPZ_1.2 24,35.77 24,38 19.19,42.81 D_PZ_1.C
  Bottom 0.305: U_MUX_0.17 72.09,28.59 v74,28
PZ_2
  Top 1.27: C_PZ_2.1 33.5,29.6 33.5,30 33.27,30.23 33.27,31.13 R_PZ_2.2 33.27,32.63 JPZ_2.2 33,35.77 33,38 28.19,42.81 D_PZ_2.C
  Bottom 0.305: U_MUX_0.18 73.36,31.14 73,31.5 37.27,31.5 JPZ_2.2
PZ_3  (1 unrouted)
  Top 1.27: 42.5,32 42.27,32.23 JPZ_3.2 42,35.77 42,37.5 37,42.5 D_PZ_3.C | R_PZ_3.2 C_PZ_3.1
  Bottom 0.305: U_MUX_0.19 74.64,31.36 74,32 45.77,32 JPZ_3.2
PZ_4
  Top 1.27: C_PZ_4.1 51.5,29.6 51.5,30 51.4,30.1 R_PZ_4.2 51.27,32.63 JPZ_4.2 51,35.77 51,37.5 46,42.5 D_PZ_4.C
  Bottom 0.305: U_MUX_0.20 75.91,32.09 75.5,32.5 54,32.5 52.27,34.5 JPZ_4.2
PZ_5
  Top 1.27: C_PZ_5.1 60.5,29.6 60.5,30 60.4,30.1 R_PZ_5.2 60.4,35.37 JPZ_5.2 60,35.77 60,37 55,42 D_PZ_5.C
  Bottom 0.305: U_MUX_0.21 77.17,31.82 76,33 62.77,33 JPZ_5.2
PZ_6
  Top 1.27: C_PZ_6.1 R_PZ_6.2 69.4,35.37 JPZ_6.2 69,35.77 69,37.5 64,42.5 D_PZ_6.C
  Bottom 0.305: U_MUX_0.22 78.44,31.55 76.5,33.5 71.27,33.5 JPZ_6.2
PZ_7
  Top 1.27: R_PZ_7.2 C_PZ_7.1 78.4,35.37 JPZ_7.2 78,35.77 78,37.5 73,42.5 D_PZ_7.C
  Bottom 0.305: U_MUX_0.23 79.72,34.05 JPZ_7.2
RX  (via drill 0.6)
  Top 0.61: v108,5.5 111,2.5 145.5,2.5 147.5,4.5 147.5,13.5 143,18 143,23.46 U_ARD.2
  Bottom 0.61: R_MIDI_1.2 v108,5.5
SW_00
  Bottom 0.305: U_MUX_0.6 74.64,17.64 74.5,17.5 66.08,17.5 J_SW_00.1
SW_01
  Bottom 0.305: U_MUX_0.7 73.36,18.36 73,18 52.58,18 J_SW_01.1
SW_02
  Bottom 0.305: U_MUX_0.8 72.09,19.09 71.5,18.5 39.08,18.5 J_SW_02.1
SW_03  (via drill 0.5)
  Top 0.305: J_SW_03.1 21.58,15.08 25.5,19 67,19 v71,23
  Bottom 0.305: v71,23 71,20.15 U_MUX_0.9
TX  (via drill 0.6)
  Top 0.61: v105,5.5 109,1.5 146,1.5 148.5,4 148.5,14 144,18.5 144,21.92 U_ARD.1
  Bottom 0.61: R_MIDI_0.2 v105,5.5
VIN
  Top 1.27: F_PW.1 123.7,47 U_VR_5V.1
  Bottom 1.27: C_VR_0.1 124.4,43.6 123.5,44.5 123.5,47.12 U_VR_5V.1

### Text on the board
t_Silk: VOUT / / / / VIN | J_PZ_0 | J_PZ_1 | J_PZ_2 | J_PZ_3 | J_PZ_4 | J_PZ_5 | J_PZ_6 | J_PZ_7 | A1 | A2 | A3 | GND | GND | GND | GND | GND | D7 | D8 | D9 | 5V | 5V | 5V | 5V | 5V | Check the Fuse in case / the board is not powered | D_PZ_0 | D_PZ_1 | D_PZ_2 | D_PZ_3 | D_PZ_4 | D_PZ_5 | D_PZ_6 | D_PZ_7 | F_PW | J_PW | H3_MIDISmallController / Rev_1 | LED_PW | Spain, 2017 | R_PZ_0 | R_PZ_1 | R_PZ_2 | R_PZ_3 | R_PZ_4 | R_PZ_5 | R_PZ_6 | R_PZ_7 | J_LED | J_EXT_0 | J_EXT_1 | J_PWSEL | C_PZ_0 | C_PZ_1 | C_PZ_2 | C_PZ_3 | C_PZ_4 | C_PZ_5 | C_PZ_6 | C_PZ_7 | C_LED_0 | GND / LED / 5V | U_VR_5V | R_PW | Collaborators: / Un instrumento / para Henar / Autofabricantes / Celeo Proyectos / Medialab Prado | R_LEDSTR | LED_IN / LED_OUT / 5V / GND / SW_03 | LED_IN / LED_OUT / 5V / GND / SW_02 | LED_IN / LED_OUT / 5V / GND / SW_01 | LED_IN / LED_OUT / 5V / GND | 5V / POT_3 / GND | 5V / POT_2 / GND | 5V / POT_1 / GND | 5V / POT_0 / GND | LED_0 | J_SW_03 | J_SW_02 | J_SW_01 | J_SW_00 | J_POT_3 | J_POT_2 | J_POT_1 | J_POT_0 | J_MIDI | Licensed / CC BY-SA 3.0 | U_ARD
b_Silk: C_MUX | U_MUX | GND / 5V / RX / TX | J_MIDI | TX / RX / RST(NC) / GND / LED_STR / MUX_A / MUX_B / MUX_C / MUX_D / LED_R / LED_G / LED_B | RAW(NC) / GND / RST(NC) / 5V_ARD / A3(NC) / MUX_2 / MUX_1 / MUX_0 / D13(NC) / D12(NC) / D11(NC) / D10(NC) | R_MIDI_0 | R_MIDI_1 | R_MIDI_2